# Altium schematic sheet bidirectional_switch.SchDoc
size A
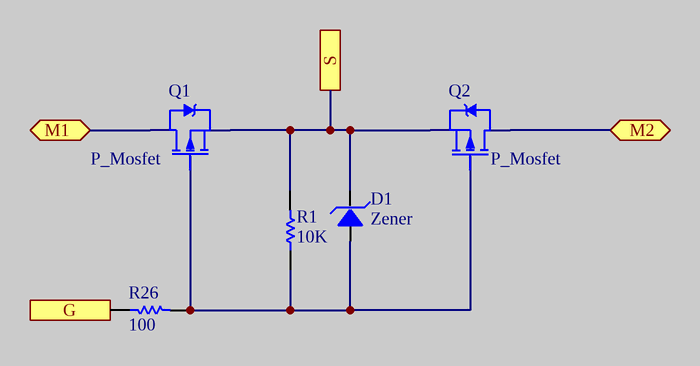
[diagram p0: bidirectional_switch.SchDoc]

## Parts
D1  Zener  [ZENER]
Q1  P_Mosfet  [dpak]
Q2  P_Mosfet  [dpak]
R1  10K  [RESC0603]
R26  100  [RESC0603]

## Ports
G (out), M1 (bidir), M2 (bidir), S

## Nets
G: R26.1 ; port G
M1: Q1.2(D) ; port M1
M2: Q2.2(D) ; port M2
S: D1.2(K) Q1.3(S) Q2.3(S) R1.2 ; port S
NetD1_1: D1.1(A) Q1.1(G) Q2.1(G) R1.1 R26.2

## Library data of the parts
Q1 Q2 = P_Mosfet IRF5305
R1 R26 = Resistor: 0603,0.1W; Published: 8-Jun-2000; LatestRevisionDate: 17-Jul-2002; LatestRevisionNote: Re-released for DXP Platform.; PackageReference: AXIAL-0.5; Publisher: Altium Limited
  R1: Value: 10K
  R26: Value: 100